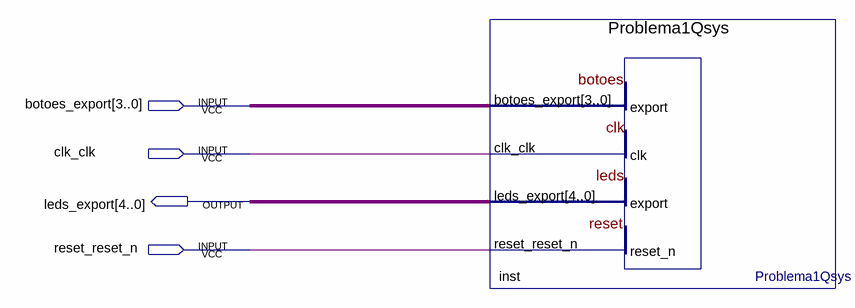
[diagram p0: schematic sheet]
// Quartus schematic Problema1.bdf as structural Verilog: 1 symbols, 4 pins
module Problema1 (
  input  [3:0] botoes_export,
  input  clk_clk,
  input  reset_reset_n,
  output [4:0] leds_export
);

  Problema1Qsys inst (
    .botoes_export(botoes_export), .clk_clk(clk_clk), .reset_reset_n(reset_reset_n), .leds_export(leds_export));
endmodule
